# Altium project DD_TempeMax.PrjPcb
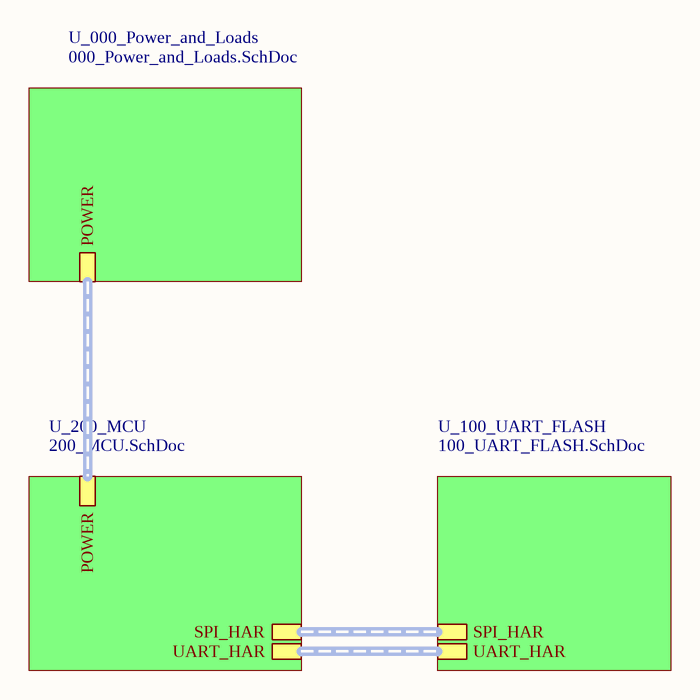
[diagram p0: main.SchDoc]
4 sheets, 85 parts. Net scope: hierarchical (ports join the sheet entries above them; power ports are global).
Board file: TempeMax.PcbDoc
Sheets:
  main.SchDoc
    U_200_MCU = 200_MCU.SchDoc
    U_000_Power_and_Loads = 000_Power_and_Loads.SchDoc
    U_100_UART_FLASH = 100_UART_FLASH.SchDoc

## Sheet main.SchDoc: TempeMaxMain
size A4; Date: 20232403; ApprovedBy: yo; CheckedBy: yo; Author: jmurilloh, jsarriac; CompanyName: UN; Organization: UN; DocumentNumber: 1; Revision: 0.1; SheetNumber: 1; SheetTotal: 4

### Sub-sheets
U_000_Power_and_Loads = 000_Power_and_Loads.SchDoc: POWER (harness POWER_AND_LOADS)
U_100_UART_FLASH = 100_UART_FLASH.SchDoc: UART_HAR (harness UART_HAR), SPI_HAR (harness SPI_HAR)
U_200_MCU = 200_MCU.SchDoc: UART_HAR (harness UART_HAR), SPI_HAR (harness SPI_HAR), POWER (harness POWER_AND_LOADS)

### Buses and harness runs
harness sheet U_000_Power_and_Loads/POWER = sheet U_200_MCU/POWER
harness sheet U_100_UART_FLASH/SPI_HAR = sheet U_200_MCU/SPI_HAR
harness sheet U_100_UART_FLASH/UART_HAR = sheet U_200_MCU/UART_HAR

### Notes on the sheet
- Title
- Size:
- Date:
- A4
- Number:
- Time:
- Revision:
- Sheet
- of
- File:

## Sheet 200_MCU.SchDoc: TempeMaxMCU
size A4; DocumentNumber: 1; Revision: 0.1; SheetNumber: 3; SheetTotal: 4
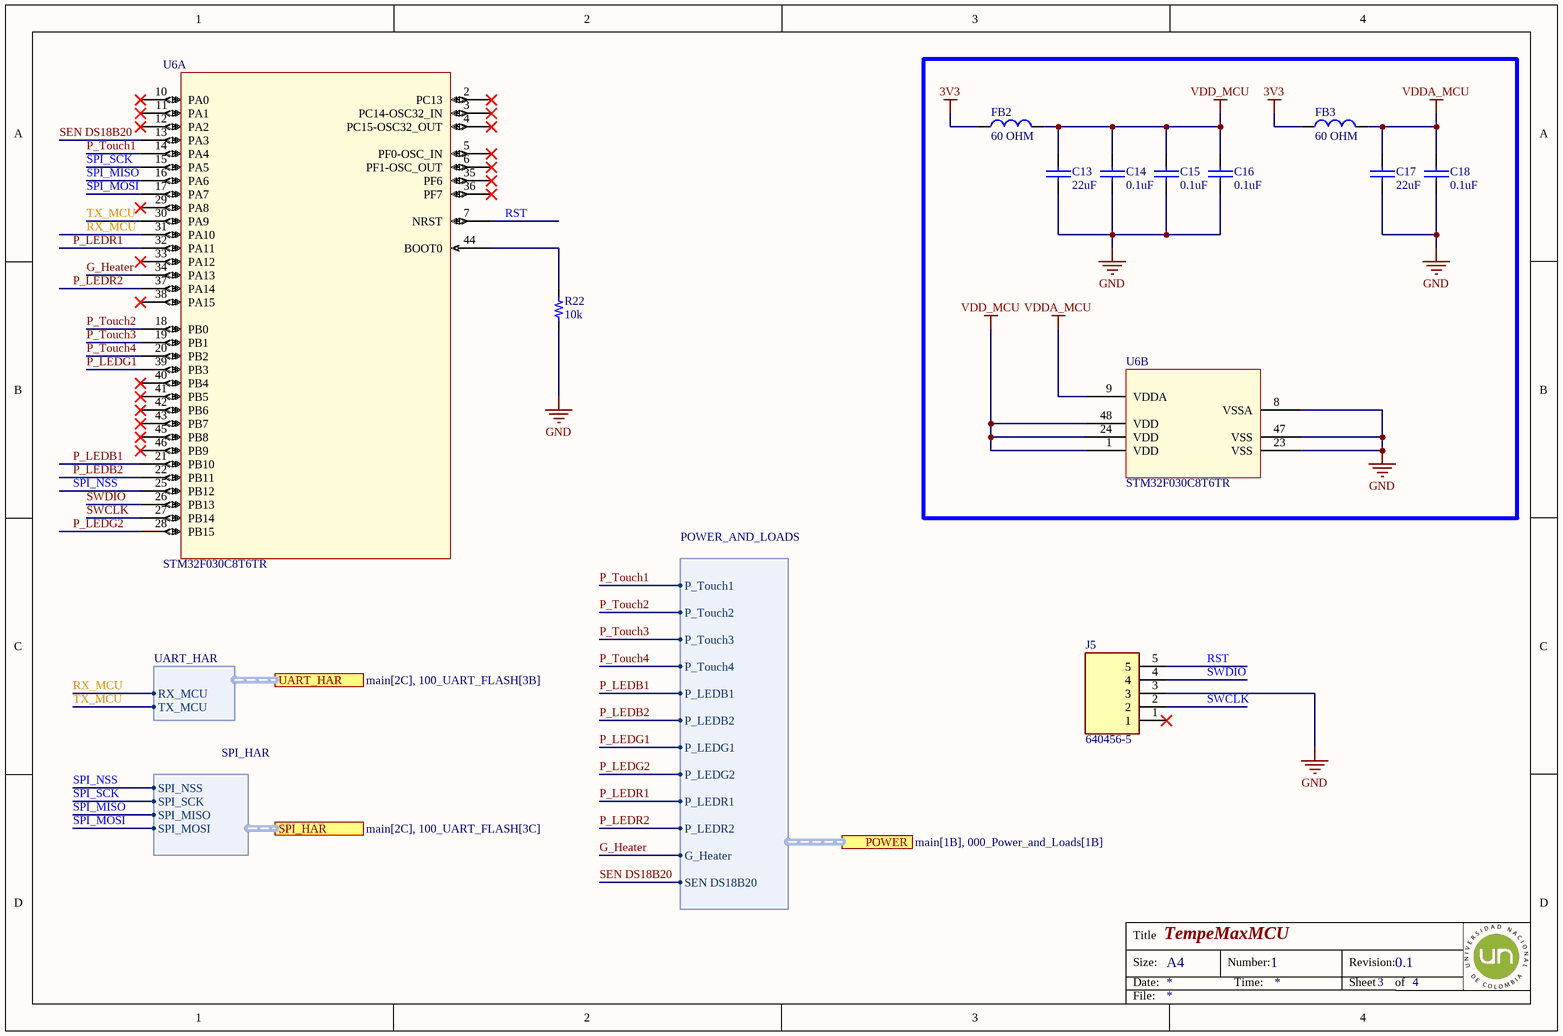
[diagram p1: 200_MCU.SchDoc]

### Parts
C13  value 22uF  [0603_cap]  (hidden comment: 22uF 6V3)
C14  value 0.1uF  [0603_cap]  (hidden comment: 0.1uF 50V)
C15  value 0.1uF  [0603_cap]  (hidden comment: 0.1uF 50V)
C16  value 0.1uF  [0603_cap]  (hidden comment: 0.1uF 50V)
C17  value 22uF  [0603_cap]  (hidden comment: 22uF 6V3)
C18  value 0.1uF  [0603_cap]  (hidden comment: 0.1uF 50V)
FB2  value 60 OHM  [0603_fb]  (hidden comment: 60OHM 2A)
FB3  value 60 OHM  [0603_fb]  (hidden comment: 60OHM 2A)
J5  640456-5  [TE_640456-5]
R22  value 10k  [0603_res]  (hidden comment: 10k 1/10W)
U6  STM32F030C8T6TR  [LQFP48_7x7mm]  (parts A,B of 2)

### Ports
POWER (harness POWER_AND_LOADS, see main[1B], 000_Power_and_Loads[1B]), SPI_HAR (harness SPI_HAR, see main[2C], 100_UART_FLASH[3C]), UART_HAR (harness UART_HAR, see main[2C], 100_UART_FLASH[3B])

### Harnesses
SPI_HAR: SPI_NSS, SPI_SCK, SPI_MISO, SPI_MOSI
POWER_AND_LOADS: P_Touch1, P_Touch2, P_Touch3, P_Touch4, P_LEDB1, P_LEDB2, P_LEDG1, P_LEDG2, P_LEDR1, P_LEDR2, G_Heater, SEN DS18B20
UART_HAR: RX_MCU, TX_MCU

### Nets
3V3: FB2.1 FB3.1
GND: C13.2 C14.2 C15.2 C16.2 C17.2 C18.2 J5.3 R22.1 U6.8(VSSA) U6.23(VSS) U6.47(VSS)
VDD_MCU: C13.1 C14.1 C15.1 C16.1 FB2.2 U6.1(VDD) U6.24(VDD) U6.48(VDD)
VDDA_MCU: C17.1 C18.1 FB3.2 U6.9(VDDA)
G_Heater: U6.34(PA13) ; port POWER.G_Heater
P_LEDB1: U6.21(PB10) ; port POWER.P_LEDB1
P_LEDB2: U6.22(PB11) ; port POWER.P_LEDB2
P_LEDG1: U6.39(PB3) ; port POWER.P_LEDG1
P_LEDG2: U6.28(PB15) ; port POWER.P_LEDG2
P_LEDR1: U6.32(PA11) ; port POWER.P_LEDR1
P_LEDR2: U6.37(PA14) ; port POWER.P_LEDR2
P_Touch1: U6.14(PA4) ; port POWER.P_Touch1
P_Touch2: U6.18(PB0) ; port POWER.P_Touch2
P_Touch3: U6.19(PB1) ; port POWER.P_Touch3
P_Touch4: U6.20(PB2) ; port POWER.P_Touch4
RST: J5.5 U6.7(NRST)
RX_MCU: U6.31(PA10) ; port UART_HAR.RX_MCU
SEN DS18B20: U6.13(PA3) ; port POWER.SEN DS18B20
SPI_MISO: U6.16(PA6) ; port SPI_HAR.SPI_MISO
SPI_MOSI: U6.17(PA7) ; port SPI_HAR.SPI_MOSI
SPI_NSS: U6.25(PB12) ; port SPI_HAR.SPI_NSS
SPI_SCK: U6.15(PA5) ; port SPI_HAR.SPI_SCK
SWCLK: J5.2 U6.27(PB14)
SWDIO: J5.4 U6.26(PB13)
TX_MCU: U6.30(PA9) ; port UART_HAR.TX_MCU
NetR22_2: R22.2 U6.44(BOOT0)

Not connected (* = marked no-connect by the designer): J5 1*; U6 2(PC13)* 3(PC14-OSC32_IN)* 4(PC15-OSC32_OUT)* 5(PF0-OSC_IN)* 6(PF1-OSC_OUT)* 10(PA0)* 11(PA1)* 12(PA2)* 29(PA8)* 33(PA12)* 35(PF6)* 36(PF7)* 38(PA15)* 40(PB4)* 41(PB5)* 42(PB6)* 43(PB7)* 45(PB8)* 46(PB9)*

### Notes on the sheet
- Title
- Size:
- Date:
- A4
- Number:
- Time:
- Revision:
- Sheet
- of
- File:

### Library data of the parts
C13 C17 = Cap_22uF_0805_6V3: 6.3V 22uF X5R ±20% 0805 Multilayer Ceramic Capacitors MLCC - SMD/SMT ROHS; Manufacturer: Samsung Electro-Mechanics; Manufacturer Part Number: CL21A226MQQNNNE; Supplier 1: LCSC; Supplier Part Number 1: C5674; ComponentLink1Description: LCSC; ComponentLink1URL: https://www.lcsc.com/product-detail/Multilayer-Ceramic-Capacitors-MLCC-SMD-SMT_Samsung-Electro-Mechanics-CL21A226MQQNNNE_C5674.html
C14-C16 C18 = Cap_0.1uF_0603_50V: 50V 100nF Y5V -20%~+80% 0603 Multilayer Ceramic Capacitors MLCC - SMD/SMT ROHS; Manufacturer: Walsin Tech Corp; Manufacturer Part Number: 0603F104Z500CT; Supplier 1: LCSC; Supplier Part Number 1: C83060; ComponentLink1Description: LCSC; ComponentLink1URL: https://www.lcsc.com/product-detail/Multilayer-Ceramic-Capacitors-MLCC-SMD-SMT_Walsin-Tech-Corp-0603F104Z500CT_C83060.html
FB2 FB3 = FB_60_0603_2A: 2A 1 100mΩ 60Ω@100MHz ±25% 0603 Ferrite Beads ROHS; Manufacturer: TAI-TECH; Manufacturer Part Number: HCB1608KF-600T20; ComponentLink1Description: LCSC; ComponentLink1URL: https://www.lcsc.com/product-detail/Ferrite-Beads_TAI-TECH-HCB1608KF-600T20_C369516.html; Supplier 1: LCSC; Supplier Part Number 1: C369516
J5 = 640456-5: Header, Friction Lock; MTA-100; 5; 250 VAC; Polyester; Tin; Copper Alloy; Tin; Manufacturer: TE Connectivity; Number_of_Positions: 5; Product_Type: Connector; Centerline_Pitch: 2.54 mm[.1 in]; Value: *; Supplier part number 1: A19471-ND; SnapEDA_Link: https://www.snapeda.com/parts/640456-5/TE%20Connectivity%20AMP%20Connectors/view-part/381420/?ref=snap; TE_purchase_URL: https://www.te.com/usa-en/product-640456-5.html?te_bu=Cor&te_type=disp&te_campaign=seda_glo_cor-seda-global-disp-prtnr-fy19-seda-model-bom-cta_sma-317_1&elqCampaignId=32493; Package: None; MP: 640456-5; Digi-Key_Purchase_URL: https://www.digikey.com/product-detail/en/te-connectivity-amp-connectors/640456-5/A19471-ND/259011?utm_source=snapeda&utm_medium=aggregator&utm_campaign=symbol; EU_RoHS_Compliance: Compliant; Manufacturer part number: 640456-5; ComponentLink1Description: Digi Key; ComponentLink1URL: https://www.digikey.com/en/products/detail/te-connectivity-amp-connectors/640456-5/259011?s=N4IgTCBcDaIIIEYCcAWA7AgtAOQCIgF0BfIA; Supplier 1: Digi-Key
R22 = Res_10k_0603_1/10W: RES SMD 10k OHM 5% 1/10W 0603; Manufacturer: FOJAN; Manufacturer Part Number: FRC0603J103TS; ComponentLink1URL: https://www.lcsc.com/product-detail/Chip-Resistor-Surface-Mount_FOJAN-FRC0603J103TS_C2930027.html; Supplier 1: LCSC; Supplier Part Number 1: C2930027; ComponentLink1Description: LCSC
U6 = IC_STM32F030C8T6TR_LQFP48_7x7MM: IC MCU 32BIT 64KB FLASH 48LQFP; Manufacturer: STMicroelectronics; Manufacturer part number: STM32F030C8T6TR; Supplier 1: LCSC; Supplier Part Number 1: C23922; ComponentLink1Description: LCSC; ComponentLink1URL: https://www.lcsc.com/product-detail/ST-Microelectronics_STMicroelectronics-STM32F030C8T6_C23922.html

## Sheet 000_Power_and_Loads.SchDoc
size 431 x 279 mm; SheetNumber: 2; SheetTotal: 4
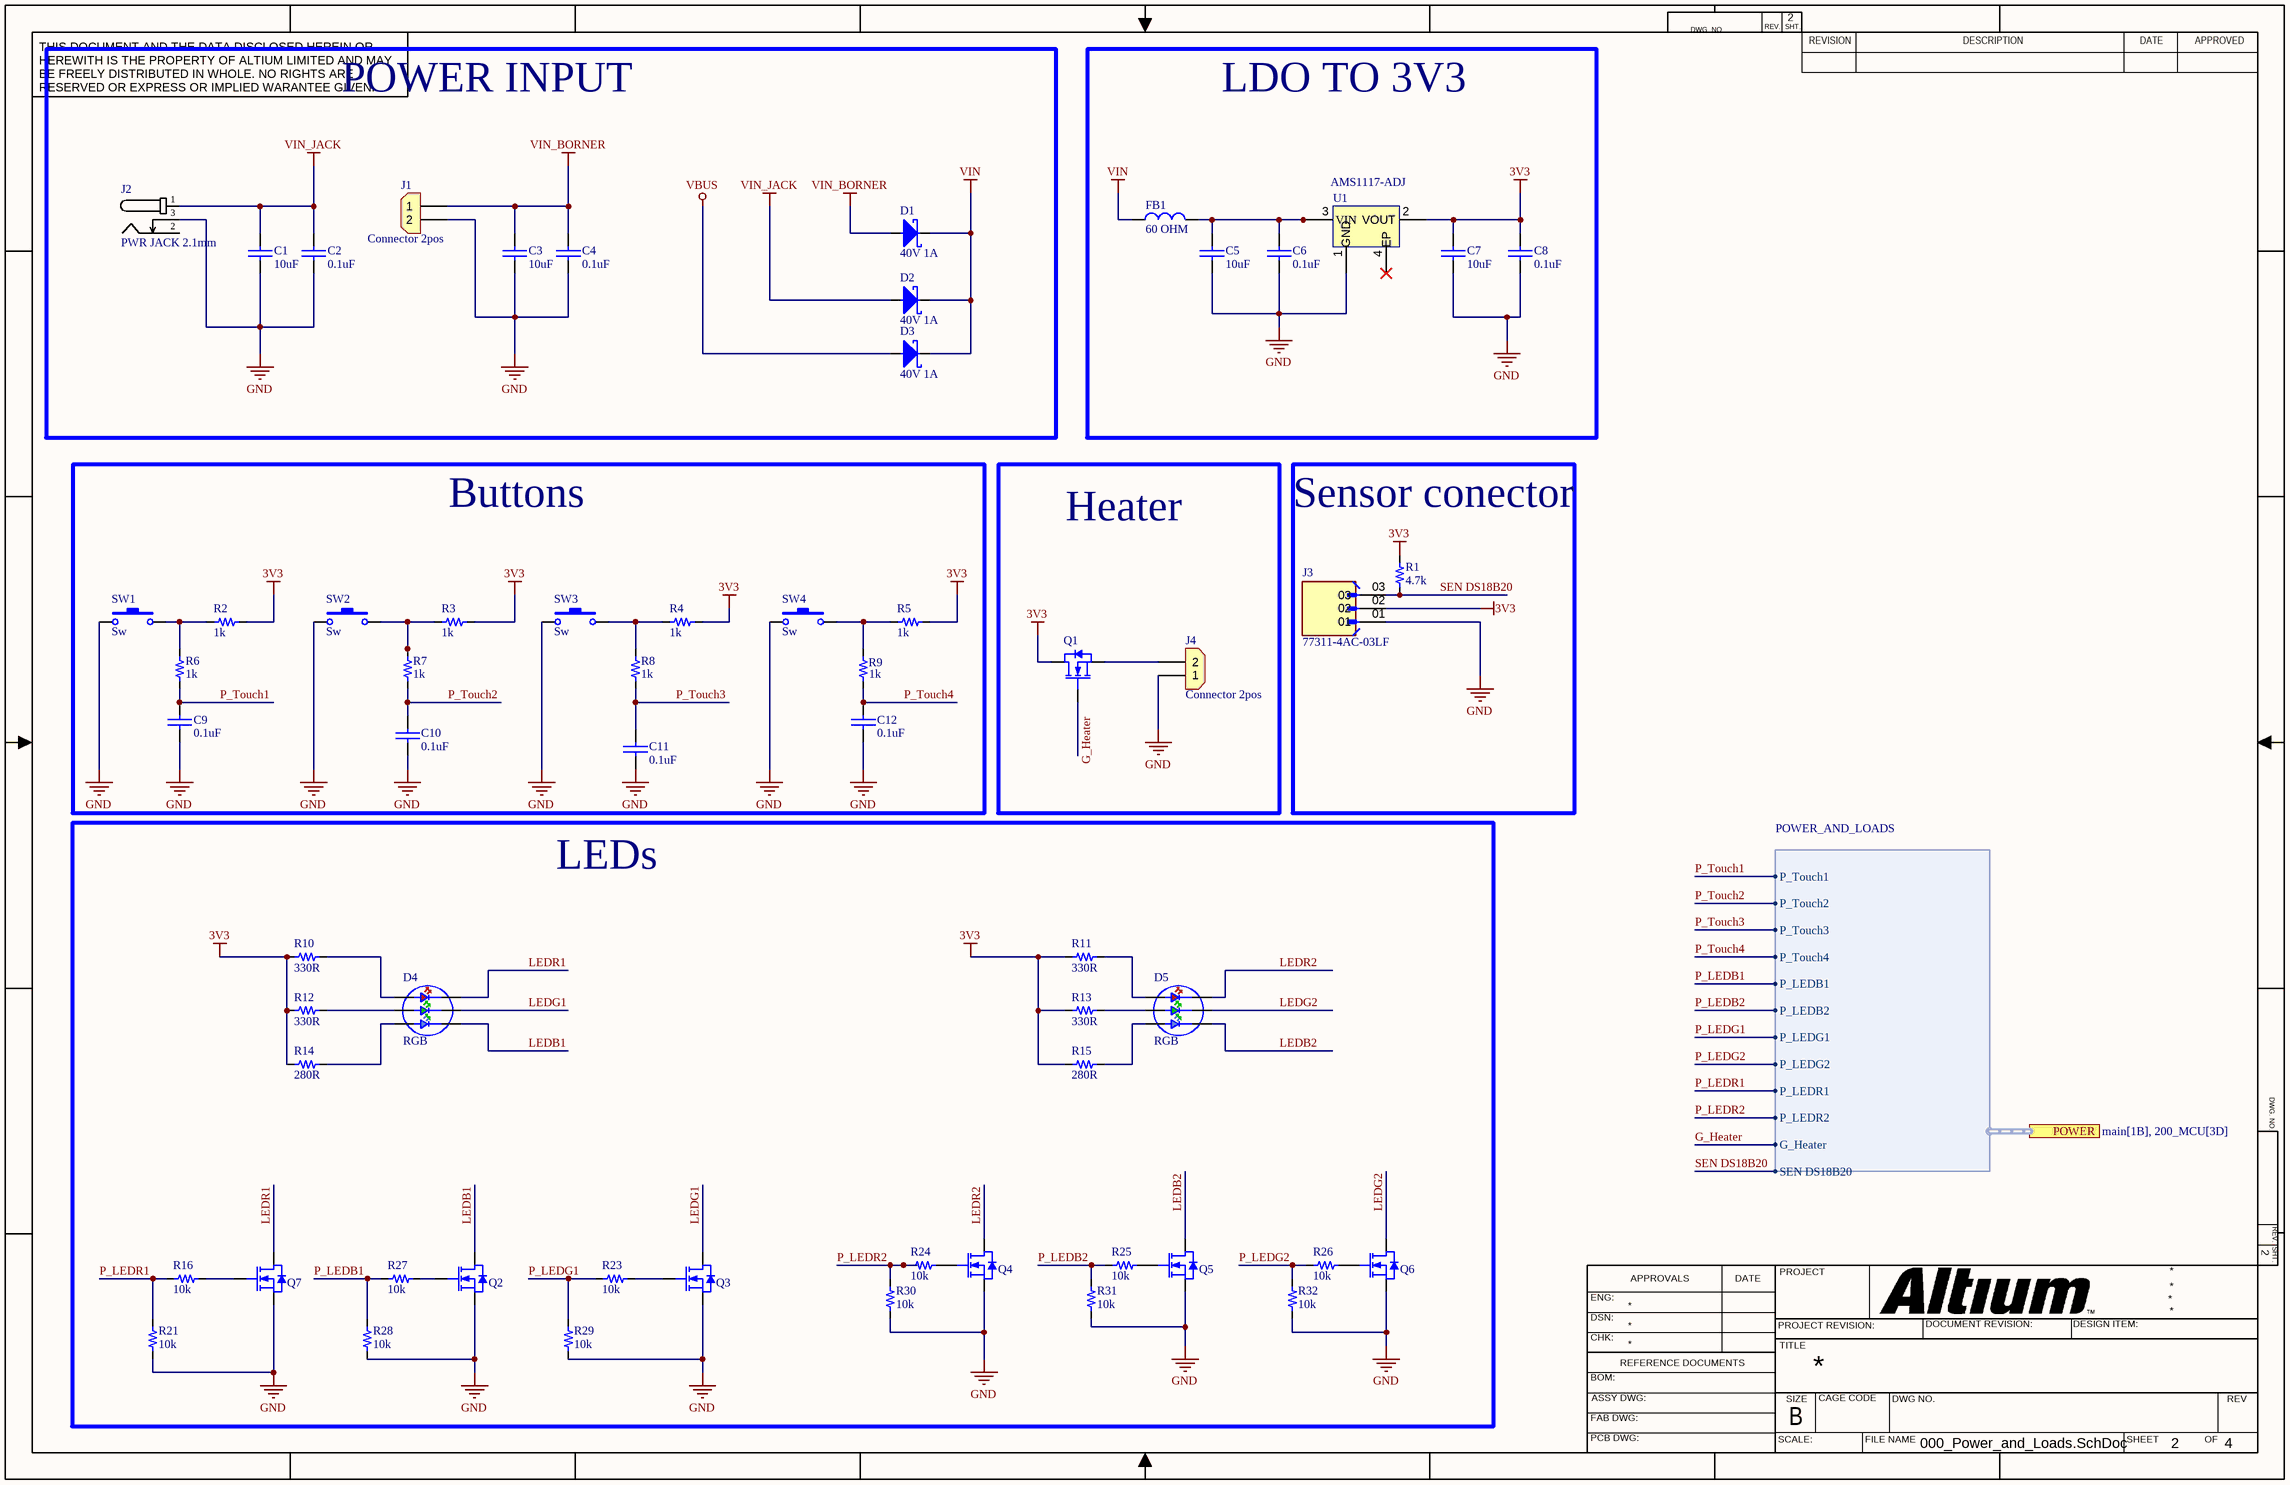
[diagram p2: 000_Power_and_Loads.SchDoc]

### Parts
C1  value 10uF  [0603_cap]  (hidden comment: 10uF 10V)
C2  value 0.1uF  [0603_cap]  (hidden comment: 0.1uF 50V)
C3  value 10uF  [0603_cap]  (hidden comment: 10uF 10V)
C4  value 0.1uF  [0603_cap]  (hidden comment: 0.1uF 50V)
C5  value 10uF  [0603_cap]  (hidden comment: 10uF 10V)
C6  value 0.1uF  [0603_cap]  (hidden comment: 0.1uF 50V)
C7  value 10uF  [0603_cap]  (hidden comment: 10uF 10V)
C8  value 0.1uF  [0603_cap]  (hidden comment: 0.1uF 50V)
C9  value 0.1uF  [0603_cap]  (hidden comment: 0.1uF 50V)
C10  value 0.1uF  [0603_cap]  (hidden comment: 0.1uF 50V)
C11  value 0.1uF  [0603_cap]  (hidden comment: 0.1uF 50V)
C12  value 0.1uF  [0603_cap]  (hidden comment: 0.1uF 50V)
D1  40V 1A  [SOD_123]
D2  40V 1A  [SOD_123]
D3  40V 1A  [SOD_123]
D4  RGB  [RGB_NS_3.5X3.7]
D5  RGB  [RGB_NS_3.5X3.7]
FB1  value 60 OHM  [0603_fb]  (hidden comment: 60OHM 2A)
J1  Connector 2pos  [CON_2x1_TH_5MM]
J2  PWR JACK 2.1mm  [CON_POWER_BARREL_2.1MM_3CONN]
J3  77311-4AC-03LF  [AMPHENOL_77311-4AC-03LF]
J4  Connector 2pos  [CON_2x1_TH_5MM]
Q1  N CH  [SOT_23_3]  (value not drawn)
Q2  N CH  [SOT_23_3]  (value not drawn)
Q3  N CH  [SOT_23_3]  (value not drawn)
Q4  N CH  [SOT_23_3]  (value not drawn)
Q5  N CH  [SOT_23_3]  (value not drawn)
Q6  N CH  [SOT_23_3]  (value not drawn)
Q7  N CH  [SOT_23_3]  (value not drawn)
R1  value 4.7k  [0603_res]  (hidden comment: 4.7k 1/10W)
R2  value 1k  [0603_res]  (hidden comment: 1k 1/10W)
R3  value 1k  [0603_res]  (hidden comment: 1k 1/10W)
R4  value 1k  [0603_res]  (hidden comment: 1k 1/10W)
R5  value 1k  [0603_res]  (hidden comment: 1k 1/10W)
R6  value 1k  [0603_res]  (hidden comment: 1k 1/10W)
R7  value 1k  [0603_res]  (hidden comment: 1k 1/10W)
R8  value 1k  [0603_res]  (hidden comment: 1k 1/10W)
R9  value 1k  [0603_res]  (hidden comment: 1k 1/10W)
R10  value 330R  [0603_res]  (hidden comment: 330R 1/10W)
R11  value 330R  [0603_res]  (hidden comment: 330R 1/10W)
R12  value 330R  [0603_res]  (hidden comment: 330R 1/10W)
R13  value 330R  [0603_res]  (hidden comment: 330R 1/10W)
R14  value 280R  [0603_res]  (hidden comment: 280R 1/10W)
R15  value 280R  [0603_res]  (hidden comment: 280R 1/10W)
R16  value 10k  [0603_res]  (hidden comment: 10k 1/10W)
R21  value 10k  [0603_res]  (hidden comment: 10k 1/10W)
R23  value 10k  [0603_res]  (hidden comment: 10k 1/10W)
R24  value 10k  [0603_res]  (hidden comment: 10k 1/10W)
R25  value 10k  [0603_res]  (hidden comment: 10k 1/10W)
R26  value 10k  [0603_res]  (hidden comment: 10k 1/10W)
R27  value 10k  [0603_res]  (hidden comment: 10k 1/10W)
R28  value 10k  [0603_res]  (hidden comment: 10k 1/10W)
R29  value 10k  [0603_res]  (hidden comment: 10k 1/10W)
R30  value 10k  [0603_res]  (hidden comment: 10k 1/10W)
R31  value 10k  [0603_res]  (hidden comment: 10k 1/10W)
R32  value 10k  [0603_res]  (hidden comment: 10k 1/10W)
SW1  Sw  [Sw_PUSH_4.5x4.5x5mm]
SW2  Sw  [Sw_PUSH_4.5x4.5x5mm]
SW3  Sw  [Sw_PUSH_4.5x4.5x5mm]
SW4  Sw  [Sw_PUSH_4.5x4.5x5mm]
U1  AMS1117-ADJ  [SOT_223]

### Blocks framed on the sheet
POWER INPUT: C1-C4 D1-D3 J1 J2
LDO TO 3V3: C5-C8 FB1 U1
Buttons: C9-C12 R2-R9 SW1-SW4
Heater: J4 Q1
Sensor conector: J3 R1
LEDs: D4 D5 Q2-Q7 R10-R16 R21 R23-R32

### Ports
POWER (harness POWER_AND_LOADS, see main[1B], 200_MCU[3D])

### Harnesses
POWER_AND_LOADS: P_Touch1, P_Touch2, P_Touch3, P_Touch4, P_LEDB1, P_LEDB2, P_LEDG1, P_LEDG2, P_LEDR1, P_LEDR2, G_Heater, SEN DS18B20

### Nets
3V3: C7.1 C8.1 J3.02 Q1.3(D) R1.1 R2.2 R3.2 R4.2 R5.2 R10.1 R11.1 R12.1 R13.1 R14.1 R15.1 U1.2(VOUT)
GND: C1.2 C2.2 C3.2 C4.2 C5.2 C6.2 C7.2 C8.2 C9.2 C10.2 C11.2 C12.2 J1.2 J2.3 J3.01 J4.1 Q2.2(S) Q3.2(S) Q4.2(S) Q5.2(S) Q6.2(S) Q7.2(S) R21.1 R28.1 R29.1 R30.1 R31.1 R32.1 SW1.1 SW2.1 SW3.1 SW4.1 U1.1(GND)
VBUS: D3.2
VIN: D1.1 D2.1 D3.1 FB1.1
VIN_BORNER: C3.1 C4.1 D1.2 J1.1
VIN_JACK: C1.1 C2.1 D2.2 J2.1
G_Heater: Q1.1(G) ; port POWER.G_Heater
LEDB1: D4.1 Q2.3(D)
LEDB2: D5.1 Q5.3(D)
LEDG1: D4.2 Q3.3(D)
LEDG2: D5.2 Q6.3(D)
LEDR1: D4.3 Q7.3(D)
LEDR2: D5.3 Q4.3(D)
P_LEDB1: R27.2 R28.2 ; port POWER.P_LEDB1
P_LEDB2: R25.2 R31.2 ; port POWER.P_LEDB2
P_LEDG1: R23.2 R29.2 ; port POWER.P_LEDG1
P_LEDG2: R26.2 R32.2 ; port POWER.P_LEDG2
P_LEDR1: R16.2 R21.2 ; port POWER.P_LEDR1
P_LEDR2: R24.2 R30.2 ; port POWER.P_LEDR2
P_Touch1: C9.1 R6.1 ; port POWER.P_Touch1
P_Touch2: C10.1 R7.1 ; port POWER.P_Touch2
P_Touch3: C11.1 R8.1 ; port POWER.P_Touch3
P_Touch4: C12.1 R9.1 ; port POWER.P_Touch4
SEN DS18B20: J3.03 R1.2 ; port POWER.SEN DS18B20
NetC5_1: C5.1 C6.1 FB1.2 U1.3(VIN)
NetD4_4: D4.4 R10.2
NetD4_5: D4.5 R12.2
NetD4_6: D4.6 R14.2
NetD5_4: D5.4 R11.2
NetD5_5: D5.5 R13.2
NetD5_6: D5.6 R15.2
NetJ4_2: J4.2 Q1.2(S)
NetQ2_1: Q2.1(G) R27.1
NetQ3_1: Q3.1(G) R23.1
NetQ4_1: Q4.1(G) R24.1
NetQ5_1: Q5.1(G) R25.1
NetQ6_1: Q6.1(G) R26.1
NetQ7_1: Q7.1(G) R16.1
NetR2_1: R2.1 R6.2 SW1.2
NetR3_1: R3.1 R7.2 SW2.2
NetR4_1: R4.1 R8.2 SW3.2
NetR5_1: R5.1 R9.2 SW4.2

Not connected (* = marked no-connect by the designer): J2 2; U1 4(EP)*

### Notes on the sheet
- DWG. NO.
- REV.
- SHT.
- THIS DOCUMENT AND THE DATA DISCLOSED HEREIN OR HEREWITH IS THE PROPERTY OF ALTIUM LIMITED AND MAY BE FREELY DISTRIBUTED IN WHOLE. NO RIGHTS ARE RESERVED OR EXPRESS OR IMPLIED WARANTEE GIVEN.
- REVISION
- DESCRIPTION
- DATE
- APPROVED
- ENG:
- APPROVALS
- PROJECT
- DSN:
- CHK:
- REFERENCE DOCUMENTS
- PROJECT REVISION:
- TITLE
- DOCUMENT REVISION:
- DESIGN ITEM:
- BOM:
- FAB DWG:
- PCB DWG:
- ASSY DWG:
- SCALE:
- SIZE
- B
- CAGE CODE
- FILE NAME
- DWG NO.
- SHEET
- OF
- REV

### Library data of the parts
C1 C3 C5 C7 = Cap_10uF_0603_10V: 10V 10uF X5R ±10% 0603 Multilayer Ceramic Capacitors MLCC - SMD/SMT ROHS; Manufacturer: CCTC; Manufacturer Part Number: TCC0603X5R106K100CT; Supplier 1: LCSC; Supplier Part Number 1: C380314; ComponentLink1Description: LCSC; ComponentLink1URL: https://www.lcsc.com/product-detail/Multilayer-Ceramic-Capacitors-MLCC-SMD-SMT_CCTC-TCC0603X5R106K100CT_C380314.html
C2 C4 C6 C8-C12 = Cap_0.1uF_0603_50V: as C14 on sheet 200_MCU; Supplier 1: LCSC; Supplier Part Number 1: C83060; ComponentLink1Description: LCSC; ComponentLink1URL: https://www.lcsc.com/product-detail/Multilayer-Ceramic-Capacitors-MLCC-SMD-SMT_Walsin-Tech-Corp-0603F104Z500CT_C83060.html
  C9-C12: Usage: *
D1-D3 = D_Schottky_40V_1A_SOD_123F: DIODE SCHOTTKY 40V 1A SOD123F; Manufacturer: Shanghai Prisemi Elec; Manufacturer Part Number: PSBD1DF40V1H; Supplier 1: LCSC; Supplier Part Number 1: C110730; ComponentLink1Description: LCSC; ComponentLink1URL: https://www.lcsc.com/product-detail/Switching-Diode_Shanghai-Prisemi-Elec-PSBD1DF40V1H_C110730.html
D4 D5 = LED_RGB_3535_SMD: -30℃~+85℃ RGB 110° 3535(mm) Light Emitting Diodes (LED) ROHS; Manufacturer: Foshan NationStar Optoelectronics; Manufacturer Part Number: RS-3535MWAM; Supplier 1: LCSC; Supplier Part Number 1: C842778; ComponentLink1Description: LCSC; ComponentLink1URL: https://www.lcsc.com/product-detail/Light-Emitting-Diodes-LED_Foshan-NationStar-Optoelectronics-RS-3535MWAM_C842778.html
FB1 = FB_60_0603_2A: as FB2 on sheet 200_MCU; ComponentLink1Description: LCSC; ComponentLink1URL: https://www.lcsc.com/product-detail/Ferrite-Beads_TAI-TECH-HCB1608KF-600T20_C369516.html; Supplier 1: LCSC; Supplier Part Number 1: C369516
J1 J4 = Con_2x1_TH_5mm: 2POS 5MM; Manufacturer: JILN; Manufacturer Part Number: JL126-50002G01; Supplier 1: LCSC; Supplier Part Number 1: C394556; ComponentLink1Description: Digi-Key; ComponentLink1URL: https://www.lcsc.com/product-detail/Screw-terminal_JILN-JL126-50002G01_C394556.html
J2 = Con_Power_Jack_2.1mm_3pins: CONN PWR JACK 2X5.5MM SOLDER; Manufacturer: HCTL; Manufacturer Part Number: HC-DC-005-2.0T; Supplier 1: LCSC; Supplier Part Number 1: C3010533; ComponentLink1Description: LCSC; ComponentLink1URL: https://www.lcsc.com/product-detail/AC-DC-Power-Connectors_HCTL-HC-DC-005-2-0T_C3010533.html
J3 = 77311-4AC-03LF: Connector Header Through Hole 3 position 0.100" (2.54mm); Manufacturer: Amphenol ICC (FCI); Usage: *; Manufacturer Part Number: 77311-4AC-03LF; Supplier 1: Digi-Key; Supplier Part Number 1: 77311-4AC-03LF-ND; ComponentLink1Description: Digi-Key; ComponentLink1URL: https://www.digikey.com/en/products/detail/amphenol-icc-fci/77311-4AC-03LF/4404912
Q1-Q7 = Q_NFET_20V_3.2A_SOT23: MOSFET N-CH 20V SOT23; Manufacturer: Doeshare; Manufacturer Part Number: DN2302S; Supplier 1: LCSC; Supplier Part Number 1: C2931750; ComponentLink1Description: LCSC; ComponentLink1URL: https://www.lcsc.com/product-detail/MOSFETs_Doeshare-DN2302S_C2931750.html
R1 = Res_10k_0603_1/10W: RES SMD 4.7k OHM 5% 1/10W 0603; Manufacturer: FOJAN; Manufacturer Part Number: FRC0603J103TS; ComponentLink1URL: https://www.lcsc.com/product-detail/Chip-Resistor-Surface-Mount_FOJAN-FRC0603J103TS_C2930027.html; Supplier 1: LCSC; Supplier Part Number 1: C2930027; ComponentLink1Description: LCSC
R2-R9 = Res_1k_0603_1/10W: RES SMD 1k OHM 5% 1/10W 0603; Manufacturer: FOJAN; Manufacturer Part Number: FRC0603J102 TS; ComponentLink1URL: https://www.lcsc.com/product-detail/Chip-Resistor-Surface-Mount_FOJAN-FRC0603J102-TS_C2907113.html; Supplier 1: LCSC; Supplier Part Number 1: C2907113; ComponentLink1Description: LCSC
R10-R13 = Res_330R_0603_1/10W: RES SMD 330R OHM 5% 1/10W 0603; Manufacturer: FOJAN; Manufacturer Part Number: FRC0603J331 TS; ComponentLink1URL: https://www.lcsc.com/product-detail/Chip-Resistor-Surface-Mount_FOJAN-FRC0603J331-TS_C2907152.html; Supplier 1: LCSC; Supplier Part Number 1: C2907152; ComponentLink1Description: LCSC
R14 R15 = Res_330R_0603_1/10W: RES SMD 280R OHM 5% 1/10W 0603; Manufacturer: FOJAN; Manufacturer Part Number: FRC0603J331 TS; ComponentLink1URL: https://www.lcsc.com/product-detail/Chip-Resistor-Surface-Mount_FOJAN-FRC0603J331-TS_C2907152.html; Supplier 1: LCSC; Supplier Part Number 1: C2907152; ComponentLink1Description: LCSC
R16 R21 R23-R32 = Res_10k_0603_1/10W: as R22 on sheet 200_MCU; ComponentLink1URL: https://www.lcsc.com/product-detail/Chip-Resistor-Surface-Mount_FOJAN-FRC0603J103TS_C2930027.html; Supplier 1: LCSC; Supplier Part Number 1: C2930027; ComponentLink1Description: LCSC
SW1-SW4 = Sw_PUSH_4.5x4.5x5.0xmm: SWITCH TACTILE SPST-NO 0.05A 12V; Manufacturer: BZCN; Manufacturer Part Number: TSC015A05026A; Supplier 1: LCSC; Supplier Part Number 1: C2888509; Last modified by: N-A.Potosi; Last modified date: 20190222; ComponentLink1Description: LCSC; ComponentLink1URL: https://www.lcsc.com/product-detail/Tactile-Switches_BZCN-TSC015A05026A_C2888509.html
U1 = LDO_3V3_1A: 1A 70dB@(120Hz) 5mA 1.2V@1A Adjustable 1.2V~20V Positive 1 20V Output Adjustable SOT-223-3L Linear Voltage Regulators (LDO) ROHS; Manufacturer: WPMtek(Wei Pan Microelectronics); ComponentLink1Description: LCSC; ComponentLink1URL: https://www.lcsc.com/product-detail/Linear-Voltage-Regulators-LDO_WPMtek-Wei-Pan-Microelectronics-AMS1117-ADJ_C2688238.html; Supplier 1: LCSC; Manufacturer Part Number: AMS1117-ADJ; Supplier Part Number 1: C2688238; Parameter 1: *

## Sheet 100_UART_FLASH.SchDoc: TempeMaxComm
size A4; DocumentNumber: 1; Revision: 0.1; SheetNumber: 4; SheetTotal: 4
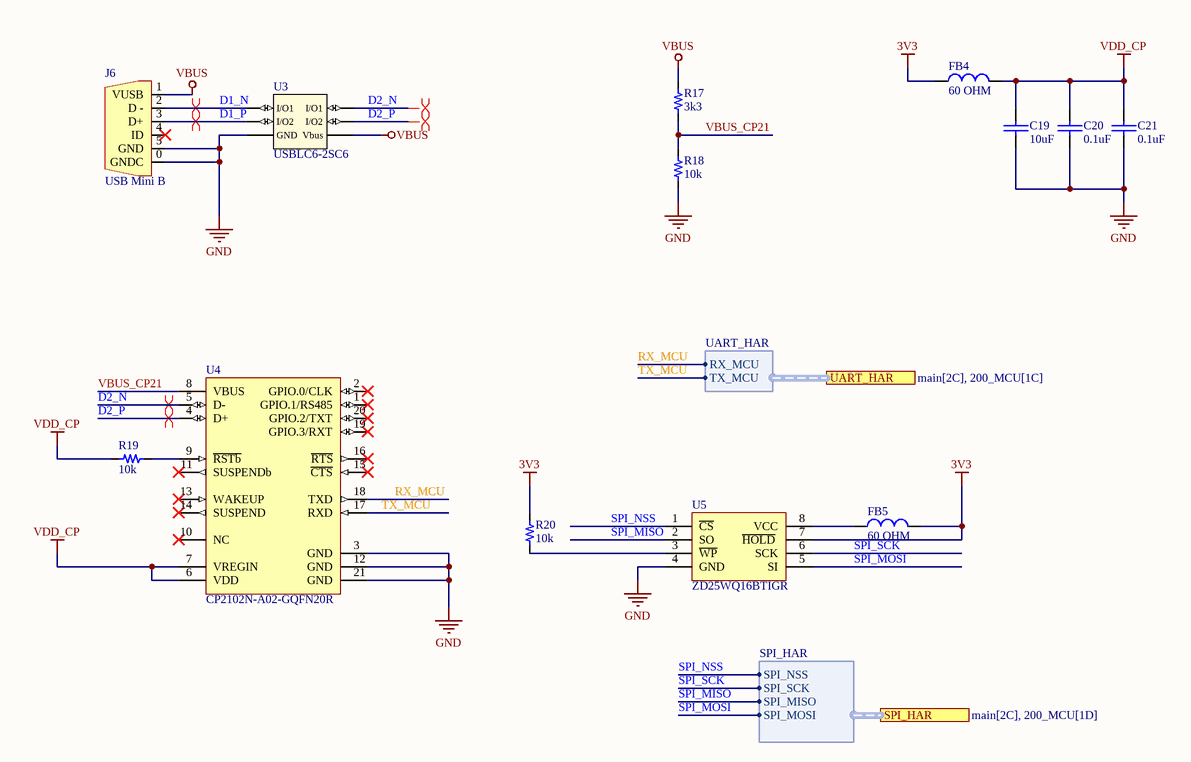
[diagram p3: 100_UART_FLASH.SchDoc]

### Parts
C19  value 10uF  [0603_cap]  (hidden comment: 10uF 10V)
C20  value 0.1uF  [0603_cap]  (hidden comment: 0.1uF 50V)
C21  value 0.1uF  [0603_cap]  (hidden comment: 0.1uF 50V)
FB4  value 60 OHM  [0603_fb]  (hidden comment: 60OHM 2A)
FB5  value 60 OHM  [0603_fb]  (hidden comment: 60OHM 2A)
J6  USB Mini B  [CON_5x1_SMD_miniUSB_B]
R17  value 3k3  [0603_res]  (hidden comment: 3k3 1/10W)
R18  value 10k  [0603_res]  (hidden comment: 10k 1/10W)
R19  value 10k  [0603_res]  (hidden comment: 10k 1/10W)
R20  value 10k  [0603_res]  (hidden comment: 10k 1/10W)
U3  USBLC6-2SC6  [SOT_23_6]
U4  CP2102N-A02-GQFN20R  [WFQFN_20_EP_3X3MM]
U5  ZD25WQ16BTIGR  [SOIC_8_3.9mm]

### Ports
SPI_HAR (harness SPI_HAR, see main[2C], 200_MCU[1D]), UART_HAR (harness UART_HAR, see main[2C], 200_MCU[1C])

### Harnesses
SPI_HAR: SPI_NSS, SPI_SCK, SPI_MISO, SPI_MOSI
UART_HAR: RX_MCU, TX_MCU

### Nets
3V3: FB4.1 FB5.2 R20.1 U5.7(~{HOLD})
GND: C19.2 C20.2 C21.2 J6.0(GNDC) J6.5(GND) R18.1 U3.2(GND) U4.3(GND) U4.12(GND) U4.21(GND) U5.4(GND)
VBUS: J6.1(VUSB) R17.2 U3.5(Vbus)
VDD_CP: C19.1 C20.1 C21.1 FB4.2 R19.2 U4.6(VDD) U4.7(VREGIN)
D1_N: J6.2(D_-) U3.1(I/O1)
D1_P: J6.3(D+) U3.3(I/O2)
D2_N: U3.6(I/O1) U4.5(D-)
D2_P: U3.4(I/O2) U4.4(D+)
RX_MCU: U4.18(TXD) ; port UART_HAR.RX_MCU
SPI_MISO: U5.2(SO) ; port SPI_HAR.SPI_MISO
SPI_MOSI: U5.5(SI) ; port SPI_HAR.SPI_MOSI
SPI_NSS: U5.1(~{CS}) ; port SPI_HAR.SPI_NSS
SPI_SCK: U5.6(SCK) ; port SPI_HAR.SPI_SCK
TX_MCU: U4.17(RXD) ; port UART_HAR.TX_MCU
VBUS_CP21: R17.1 R18.2 U4.8(VBUS)
NetFB5_1: FB5.1 U5.8(VCC)
NetR19_1: R19.1 U4.9(~{RSTb})
NetR20_2: R20.2 U5.3(~{WP})

Not connected (* = marked no-connect by the designer): J6 4(ID)*; U4 1(GPIO.1/RS485)* 2(GPIO.0/CLK)* 10(NC)* 11(SUSPENDb)* 13(WAKEUP)* 14(SUSPEND)* 15(~{CTS})* 16(~{RTS})* 19(GPIO.3/RXT)* 20(GPIO.2/TXT)*

### Layout directives
differential pair: D1_N, D1_P, D2_N, D2_P

### Notes on the sheet
- Title
- Size:
- Date:
- A4
- Number:
- Time:
- Revision:
- Sheet
- of
- File:

### Library data of the parts
C19 = Cap_10uF_0603_10V: as C1 on sheet 000_Power_and_Loads; Supplier 1: LCSC; Supplier Part Number 1: C380314; ComponentLink1Description: LCSC; ComponentLink1URL: https://www.lcsc.com/product-detail/Multilayer-Ceramic-Capacitors-MLCC-SMD-SMT_CCTC-TCC0603X5R106K100CT_C380314.html
C20 C21 = Cap_0.1uF_0603_50V: as C14 on sheet 200_MCU; Supplier 1: LCSC; Supplier Part Number 1: C83060; ComponentLink1Description: LCSC; ComponentLink1URL: https://www.lcsc.com/product-detail/Multilayer-Ceramic-Capacitors-MLCC-SMD-SMT_Walsin-Tech-Corp-0603F104Z500CT_C83060.html
FB4 FB5 = FB_60_0603_2A: as FB2 on sheet 200_MCU; ComponentLink1Description: LCSC; ComponentLink1URL: https://www.lcsc.com/product-detail/Ferrite-Beads_TAI-TECH-HCB1608KF-600T20_C369516.html; Supplier 1: LCSC; Supplier Part Number 1: C369516
J6 = Con_Mini_USB_B: CONN RCPT USB2.0 MINI B SMD R/A; Manufacturer Part Number: KH-MINI-SMT-5P-Cu; Manufacturer: EDAC Inc.; ComponentLink1Description: LCSC; ComponentLink1URL: https://datasheet.lcsc.com/lcsc/2106070035_Shenzhen-Kinghelm-Elec-KH-MINI-SMT-5P-Cu_C2688795.pdf; Supplier 1: LCSC; Supplier Part Number 1: C2688795
R17 = Res_3k3_0603_1/10W: RES SMD 3k3 OHM 5% 1/10W 0603; Manufacturer: FOJAN; Manufacturer Part Number: FRC0603J332 TS; ComponentLink1URL: https://www.lcsc.com/product-detail/Chip-Resistor-Surface-Mount_FOJAN-FRC0603J332-TS_C2907140.html; Supplier 1: LCSC; Supplier Part Number 1: C2907140; ComponentLink1Description: LCSC
R18-R20 = Res_10k_0603_1/10W: as R22 on sheet 200_MCU; ComponentLink1URL: https://www.lcsc.com/product-detail/Chip-Resistor-Surface-Mount_FOJAN-FRC0603J103TS_C2930027.html; Supplier 1: LCSC; Supplier Part Number 1: C2930027; ComponentLink1Description: LCSC
U3 = TVS_5.25V_2CH_SOT_23_6: TVS DIODE 5.25V 17V SOT23-6; Manufacturer: STMicroelectronics; ComponentLink1Description: LCSC; ComponentLink1URL: https://www.lcsc.com/product-detail/ESD-Protection-Devices_STMicroelectronics-USBLC6-2SC6_C7519.html; Supplier 1: LCSC; Manufacturer Part Number: USBLC6-2SC6; Supplier Part Number 1: C7519
U4 = IC_SGL_USB2UART-BRIDGE_20QFN: IC USB TO UART BRIDGE QFN20; Manufacturer: Silicon Labs; Manufacturer Part Number: CP2102N-A02-GQFN20R; Supplier 1: LCSC; Supplier Part Number 1: C969913; ComponentLink1Description: LCSC; ComponentLink1URL: https://www.lcsc.com/product-detail/USB-ICs_SILICON-LABS-CP2102N-A02-GQFN20R_C969913.html
U5 = IC_FLASH_ZD25WQ16BTIGR_8SOP: IC FLASH 16M SPI 85MHZ 8SOP; Manufacturer: Zetta; Manufacturer Part Number: ZD25WQ16BTIGR; Supplier 1: LCSC; Supplier Part Number 1: C2896790; ComponentLink1Description: LCSC; ComponentLink1URL: https://www.lcsc.com/product-detail/NOR-FLASH_Zetta-ZD25WQ16BTIGR_C2896790.html

## Nets that join several sheets
3V3: 200_MCU (FB2.1 FB3.1), 000_Power_and_Loads (16 pins), 100_UART_FLASH (FB4.1 FB5.2 R20.1 U5.7)
GND: 200_MCU (11 pins), 000_Power_and_Loads (33 pins), 100_UART_FLASH (11 pins)
VBUS: 000_Power_and_Loads (D3.2), 100_UART_FLASH (J6.1 R17.2 U3.5)
G_Heater: 200_MCU (U6.34), 000_Power_and_Loads (Q1.1)
P_LEDB1: 200_MCU (U6.21), 000_Power_and_Loads (R27.2 R28.2)
P_LEDB2: 200_MCU (U6.22), 000_Power_and_Loads (R25.2 R31.2)
P_LEDG1: 200_MCU (U6.39), 000_Power_and_Loads (R23.2 R29.2)
P_LEDG2: 200_MCU (U6.28), 000_Power_and_Loads (R26.2 R32.2)
P_LEDR1: 200_MCU (U6.32), 000_Power_and_Loads (R16.2 R21.2)
P_LEDR2: 200_MCU (U6.37), 000_Power_and_Loads (R24.2 R30.2)
P_Touch1: 200_MCU (U6.14), 000_Power_and_Loads (C9.1 R6.1)
P_Touch2: 200_MCU (U6.18), 000_Power_and_Loads (C10.1 R7.1)
P_Touch3: 200_MCU (U6.19), 000_Power_and_Loads (C11.1 R8.1)
P_Touch4: 200_MCU (U6.20), 000_Power_and_Loads (C12.1 R9.1)
RX_MCU: 200_MCU (U6.31), 100_UART_FLASH (U4.18)
SEN DS18B20: 200_MCU (U6.13), 000_Power_and_Loads (J3.03 R1.2)
SPI_MISO: 200_MCU (U6.16), 100_UART_FLASH (U5.2)
SPI_MOSI: 200_MCU (U6.17), 100_UART_FLASH (U5.5)
SPI_NSS: 200_MCU (U6.25), 100_UART_FLASH (U5.1)
SPI_SCK: 200_MCU (U6.15), 100_UART_FLASH (U5.6)
TX_MCU: 200_MCU (U6.30), 100_UART_FLASH (U4.17)